# EAGLE design Card_Edge_Connector (EAGLE 6.5.0)
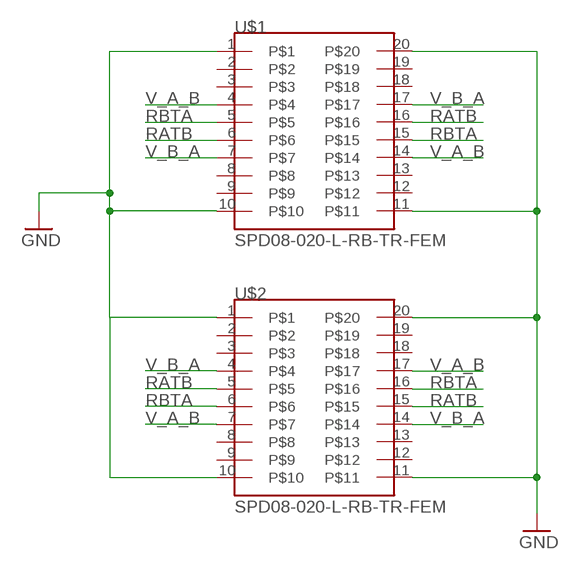
[diagram p0: schematic, sheet 1]

## Parts
U$1  SPD08-020-L-RB-TR-FEM  [SPD08-020-L-RB-TR-MALE]
U$2  SPD08-020-L-RB-TR-FEM  [SPD08-020-L-RB-TR-MALE]

## Nets
GND: U$1.1 U$1.10 U$1.11 U$1.20 U$2.1 U$2.10 U$2.11 U$2.20
RATB: U$1.6 U$1.16 U$2.5 U$2.15
RBTA: U$1.5 U$1.15 U$2.6 U$2.16
V_A_B: U$1.4 U$1.14 U$2.7 U$2.17
V_B_A: U$1.7 U$1.17 U$2.4 U$2.14
Unconnected: U$1.2 U$1.3 U$1.8 U$1.9 U$1.12 U$1.13 U$1.18 U$1.19 U$2.2 U$2.3 U$2.8 U$2.9 U$2.12 U$2.13 U$2.18 U$2.19

## Library data of the parts
U$1 U$2 = Local_RUBICS:SPD08-020-L-RB-TR-FEM

## Board
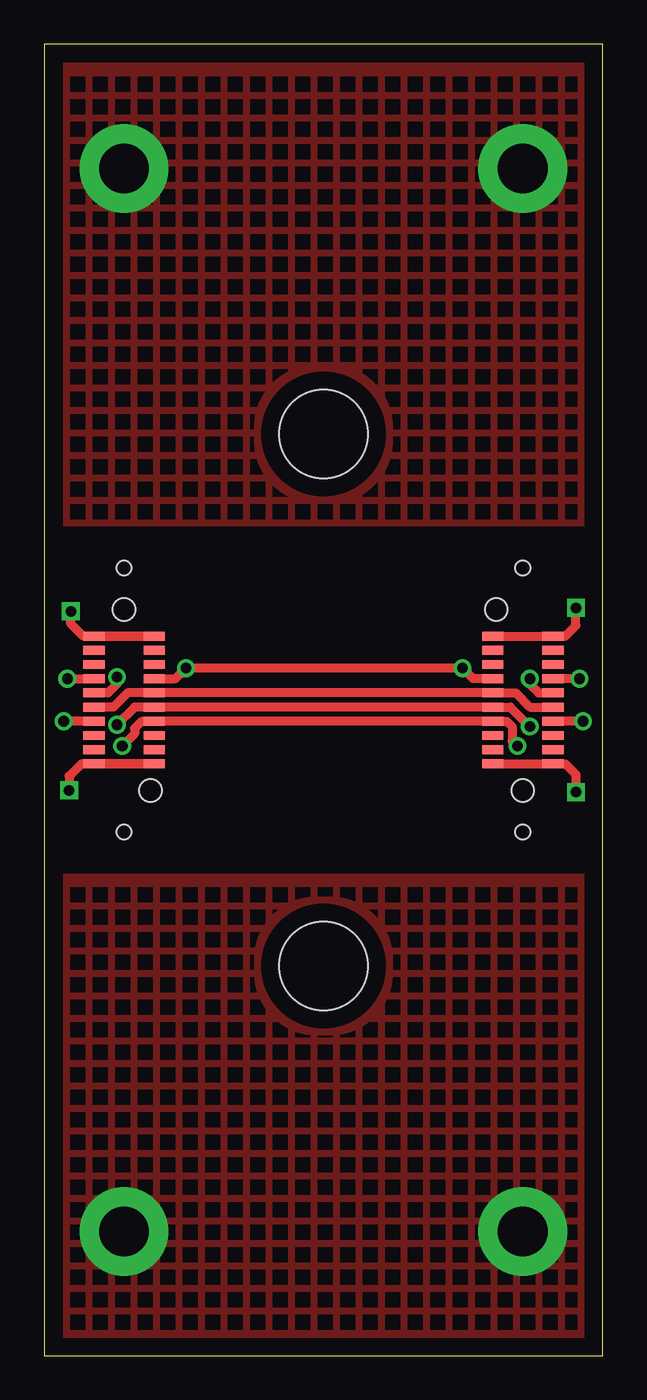
[diagram p1: board, top side]
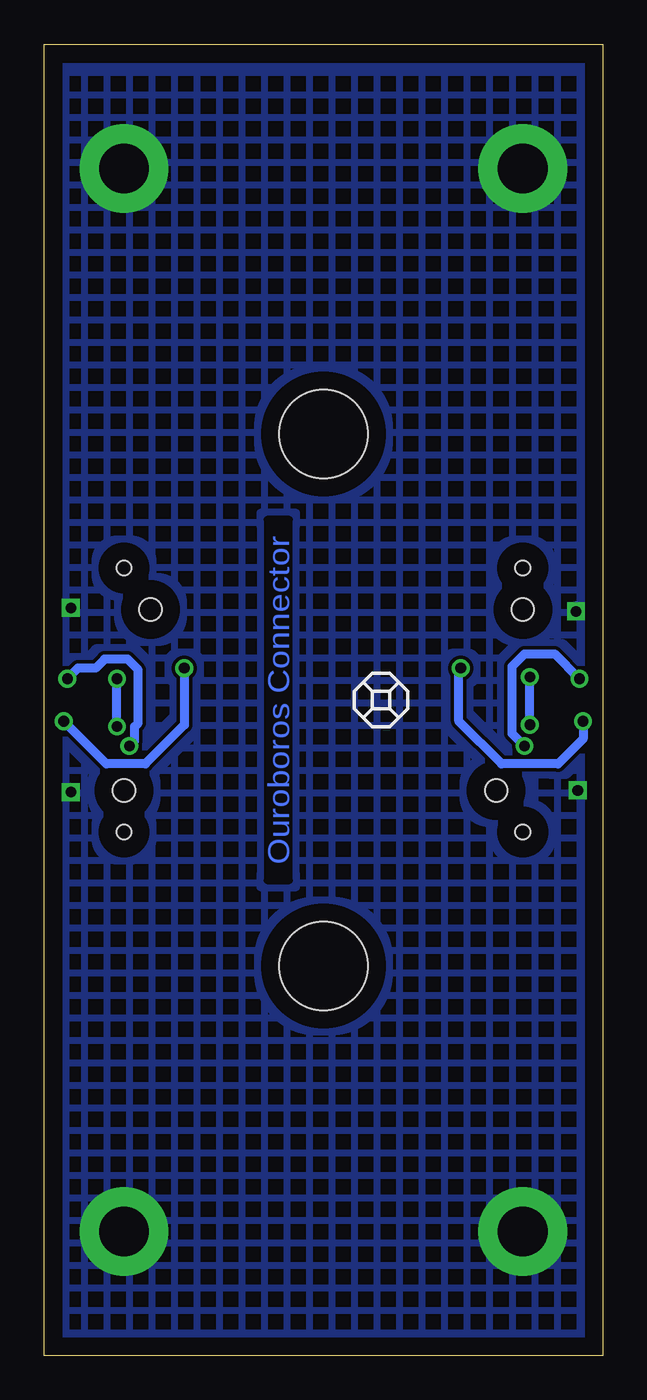
[diagram p2: board, bottom side, seen from below]

Size 31.5 x 74 mm. Coordinates in mm from the lower left corner, seen from the top.
Outline: 0,0 31.5,0 31.5,74 0,74 0,0
Copper layers (1*(4*8)*16): Top 0.035mm / dielectric 0.67375mm / Route4 0.035mm / dielectric 0.1mm / Route8 0.035mm / dielectric 0.67375mm / Bottom 0.035mm
Design rules "default *": minimum track width 10mil, minimum drill 24mil, track to track 8mil, track to pad 8mil, pad to pad 8mil, via to via 8mil, smd to smd 8mil, copper to edge 40mil, drill to drill 8mil, minimum pad ring 10mil, minimum via ring 8mil, stop-mask expansion 4mil, vias tented up to drill 0mil, thermal gap 10mil
Holes 5 mm at 15.75,52 15.75,22

### Footprints (pad centres in the part's own frame; a part is rotated, then mirrored left to right if it is on the bottom)
SPD08-020-L-RB-TR-MALE = smd 0.5 x 1.2: 1 -3.6,-1.7; 2 -2.8,-1.7; 3 -2,-1.7; 4 -1.2,-1.7; 5 -0.4,-1.7; 6 0.4,-1.7; 7 1.2,-1.7; 8 2,-1.7; 9 2.8,-1.7; 10 3.6,-1.7; 11 3.6,1.7; 12 2.8,1.7; 13 2,1.7; 14 1.2,1.7; 15 0.4,1.7; 16 -0.4,1.7; 17 -1.2,1.7; 18 -2,1.7; 19 -2.8,1.7; 20 -3.6,1.7 | hole 0.84: -7.45,0; 7.45,0 | hole 1.27: -5.1,-1.5; 5.1,0

### Placement (x,y rotation side)
U$1  27,37 270 top
U$2  4.5,37 90 top

### Tracks (layer width: path | path; a pad name or v marks a point on that pad's centre or on a via)
GND  (via drill 0.6, 2.8 pad 5)
  Top 0.5: U$1.1 U$1.20 29.4,40.6 30,41.2 v30,42.2 | U$1.10 U$1.11 29.4,33.4 30,32.8 v30,31.8 | U$2.11 U$2.10 2.2,40.6 1.5,41.3 v1.5,42 | U$2.20 U$2.1 2.1,33.4 1.4,32.7 v1.4,31.9
  Bottom 0.5: v30,31.8 30,31.7 | v30,42.2 30,42.4 | v1.4,31.9 1.4,31.8 | v1.5,42 1.5,42.3
  other vias: 4.5,67 27,67 27,7 4.5,7
  pour Bottom (hatched): 1,1 30.5,1 30.5,73 1,73
  pour Top (hatched): 1,47 30.5,47 30.5,73 1,73
  pour Top (hatched): 1,1 30.5,1 30.5,27 1,27
RATB  (via drill 0.6)
  Top 0.5: v27.4,35.5 26.3,36.6 U$1.6 U$2.5 5.1,36.6 v4.1,35.6 | v27.4,38.2 27.4,37.9 27.9,37.4 U$1.16 | v4.1,38.3 4.1,37.9 3.6,37.4 U$2.15
  Bottom 0.5: v27.4,35.5 v27.4,38.2 | v4.1,35.6 v4.1,38.3
RBTA
  Top 0.5: U$1.15 27.4,36.6 26.6,37.4 U$1.5 U$2.6 4.7,37.4 3.9,36.6 U$2.16
V_A_B  (via drill 0.6)
  Top 0.5: U$1.4 24.2,38.2 v23.6,38.8 v8,38.8 7.65,38.45 7.4,38.2 U$2.7 | v30.4,35.8 U$1.14 | U$2.17 v1.1,35.8
  Bottom 0.5: v23.6,38.8 23.6,35.6 25.8,33.4 28,33.4 v30.4,35.8 | v1.1,35.8 1.1,34.8 2.5,33.4 5.7,33.4 8.1,35.8 8.1,38.7 v8,38.8
V_B_A  (via drill 0.6)
  Top 0.5: v26.7,34.4 26.4,34.7 26.4,35.5 26.1,35.8 U$1.7 U$2.4 5.5,35.8 5.1,35.4 5.1,35.1 v4.4,34.4 | v30.2,38.2 U$1.17 | v1.3,38.2 U$2.14
  Bottom 0.5: v26.7,34.4 26.4,34.7 26.4,35.5 26.2,35.7 26.2,38.7 26.8,39.3 28.1,39.3 28.6,38.8 29.6,38.8 v30.2,38.2 | v4.4,34.4 5.1,35.1 5.1,38.9 4.4,39.6 2.7,39.6 v1.3,38.2

### Text on the board
Bottom: Ouroboros Connector